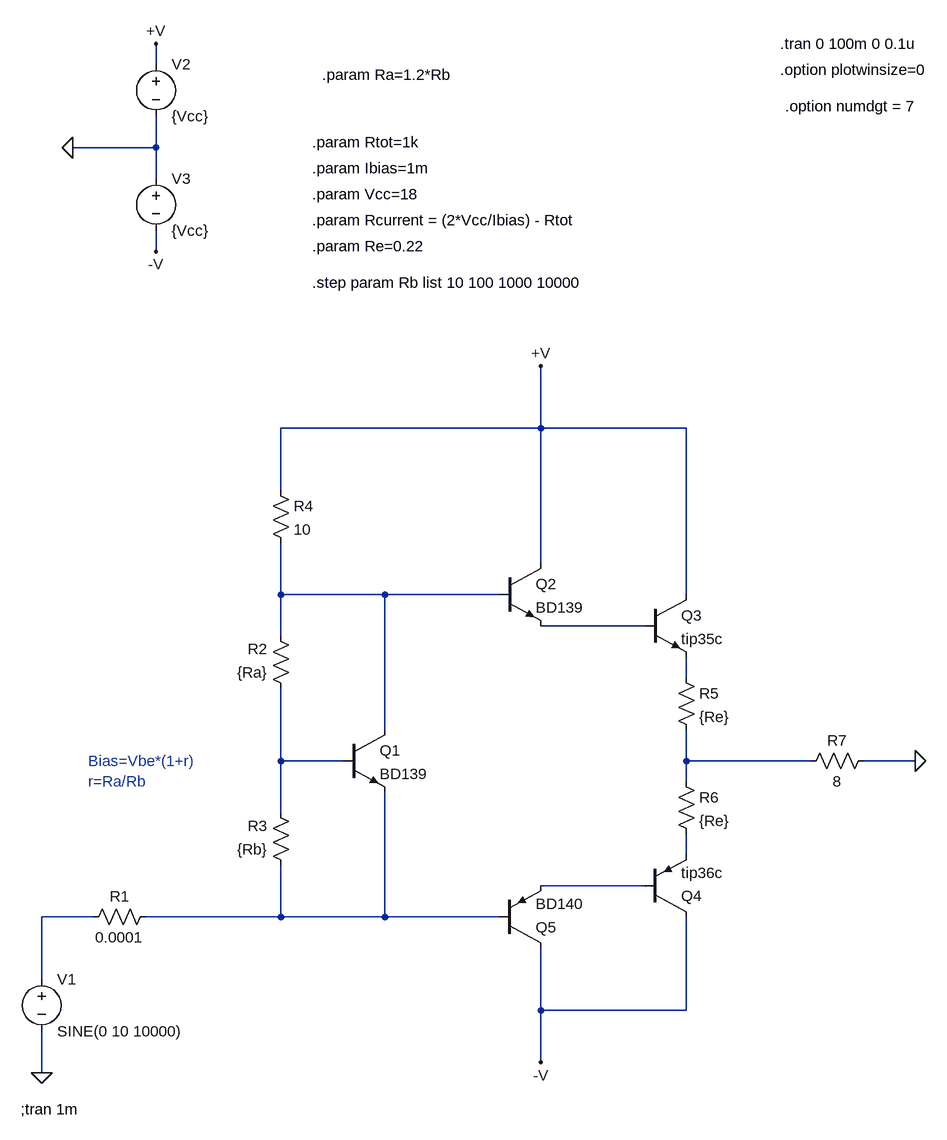
[diagram p0: schematic Bias current.asc]
Bias current.asc, the LTspice schematic file:
Version 4
SHEET 1 880 680
WIRE -608 -992 -608 -1024
WIRE -608 -864 -608 -912
WIRE -608 -864 -736 -864
WIRE -608 -816 -608 -864
WIRE -608 -704 -608 -736
WIRE -16 -432 -16 -528
WIRE -16 -432 -416 -432
WIRE 208 -432 -16 -432
WIRE -416 -336 -416 -432
WIRE -16 -224 -16 -432
WIRE -416 -176 -416 -256
WIRE -256 -176 -416 -176
WIRE -80 -176 -256 -176
WIRE 208 -176 208 -432
WIRE 144 -128 -16 -128
WIRE -416 -112 -416 -176
WIRE 208 -48 208 -80
WIRE -256 32 -256 -176
WIRE -416 80 -416 -32
WIRE -320 80 -416 80
WIRE 208 80 208 32
WIRE 400 80 208 80
WIRE 560 80 480 80
WIRE 208 112 208 80
WIRE -416 160 -416 80
WIRE 208 224 208 192
WIRE 144 272 -16 272
WIRE -704 320 -784 320
WIRE -416 320 -416 240
WIRE -416 320 -624 320
WIRE -256 320 -256 128
WIRE -256 320 -416 320
WIRE -80 320 -256 320
WIRE -784 416 -784 320
WIRE -16 464 -16 368
WIRE 208 464 208 320
WIRE 208 464 -16 464
WIRE -16 544 -16 464
WIRE -784 560 -784 496
FLAG -16 -528 +V
FLAG -16 544 -V
FLAG -784 560 0
FLAG -736 -864 0
FLAG -608 -1024 +V
FLAG -608 -704 -V
FLAG 560 80 0
SYMBOL voltage -784 400 R0
WINDOW 123 0 0 Left 0
WINDOW 39 0 0 Left 0
SYMATTR InstName V1
SYMATTR Value SINE(0 10 10000)
SYMBOL res -608 304 R90
WINDOW 0 0 56 VBottom 2
WINDOW 3 32 56 VTop 2
SYMATTR InstName R1
SYMATTR Value 0.0001
SYMBOL res -400 -16 R180
WINDOW 0 36 76 Left 2
WINDOW 3 36 40 Left 2
SYMATTR InstName R2
SYMATTR Value {Ra}
SYMBOL res -400 256 R180
WINDOW 0 36 76 Left 2
WINDOW 3 36 40 Left 2
SYMATTR InstName R3
SYMATTR Value {Rb}
SYMBOL npn -320 32 R0
SYMATTR InstName Q1
SYMATTR Value BD139
SYMBOL npn -80 -224 R0
SYMATTR InstName Q2
SYMATTR Value BD139
SYMBOL npn 144 -176 R0
SYMATTR InstName Q3
SYMATTR Value tip35c
SYMBOL res -432 -352 R0
SYMATTR InstName R4
SYMATTR Value 10
SYMBOL pnp 144 320 M180
SYMATTR InstName Q4
SYMATTR Value tip36c
SYMBOL pnp -80 368 M180
SYMATTR InstName Q5
SYMATTR Value BD140
SYMBOL res 192 -64 R0
SYMATTR InstName R5
SYMATTR Value {Re}
SYMBOL res 192 96 R0
SYMATTR InstName R6
SYMATTR Value {Re}
SYMBOL voltage -608 -1008 R0
WINDOW 123 0 0 Left 0
WINDOW 39 0 0 Left 0
SYMATTR InstName V2
SYMATTR Value {Vcc}
SYMBOL voltage -608 -832 R0
WINDOW 123 0 0 Left 0
WINDOW 39 0 0 Left 0
SYMATTR InstName V3
SYMATTR Value {Vcc}
SYMBOL res 496 64 R90
WINDOW 0 0 56 VBottom 2
WINDOW 3 32 56 VTop 2
SYMATTR InstName R7
SYMATTR Value 8
TEXT -712 80 Left 2 ;Bias=Vbe*(1+r)\nr=Ra/Rb
TEXT -368 -872 Left 2 !.param Rtot=1k
TEXT -368 -832 Left 2 !.param Ibias=1m
TEXT -368 -792 Left 2 !.param Vcc=18
TEXT -368 -752 Left 2 !.param Rcurrent = (2*Vcc/Ibias) - Rtot
TEXT -368 -712 Left 2 !.param Re=0.22
TEXT -816 616 Left 2 !;tran 1m
TEXT 352 -1024 Left 2 !.tran 0 100m 0 0.1u
TEXT 352 -984 Left 2 !.option plotwinsize=0
TEXT -352 -976 Left 2 !.param Ra=1.2*Rb
TEXT -368 -656 Left 2 !.step param Rb list 10 100 1000 10000
TEXT 360 -928 Left 2 !.option numdgt = 7

The netlist it stands for:
* Bias current.asc
V1 N008 0 SINE(0 10 10000)
R1 N009 N008 0.0001
R2 N004 N001 {Ra}
R3 N009 N004 {Rb}
Q1 N001 N004 N009 0 BD139
Q2 +V N001 N002 0 BD139
Q3 +V N002 N003 0 tip35c
R4 +V N001 10
Q4 -V N007 N006 0 tip36c
Q5 -V N009 N007 0 BD140
R5 N003 N005 {Re}
R6 N005 N006 {Re}
V2 +V 0 {Vcc}
V3 0 -V {Vcc}
R7 0 N005 8
.model NPN NPN
.model PNP PNP
.lib standard.bjt
* Bias=Vbe*(1+r)
* r=Ra/Rb
.param Rtot=1k
.param Ibias=1m
.param Vcc=18
.param Rcurrent = (2*Vcc/Ibias) - Rtot
.param Re=0.22
;tran 1m
.tran 0 100m 0 0.1u
.option plotwinsize=0
.param Ra=1.2*Rb
.step param Rb list 10 100 1000 10000
.option numdgt = 7
.backanno
.end